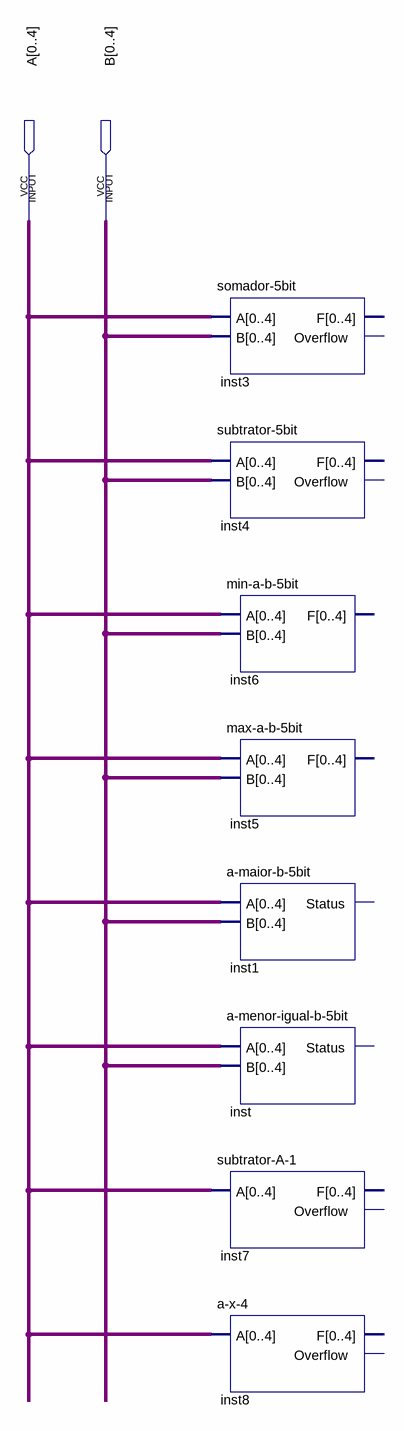
[diagram p0: schematic sheet]
// Quartus schematic mux-modulos.bdf as structural Verilog: 8 symbols, 2 pins
module \mux-modulos  (
  input  [0:4] A,
  input  [0:4] B
);

  \somador-5bit  inst3 (.A(A), .B(B));  // open: F, Overflow
  \subtrator-5bit  inst4 (.A(A), .B(B));  // open: F, Overflow
  \min-a-b-5bit  inst6 (.A(A), .B(B));  // open: F
  \max-a-b-5bit  inst5 (.A(A), .B(B));  // open: F
  \a-maior-b-5bit  inst1 (.A(A), .B(B));  // open: Status
  \a-menor-igual-b-5bit  inst (.A(A), .B(B));  // open: Status
  \subtrator-A-1  inst7 (.A(A));  // open: F, Overflow
  \a-x-4  inst8 (.A(A));  // open: F, Overflow
endmodule
